# Altium project mecanum_car.PrjPcb
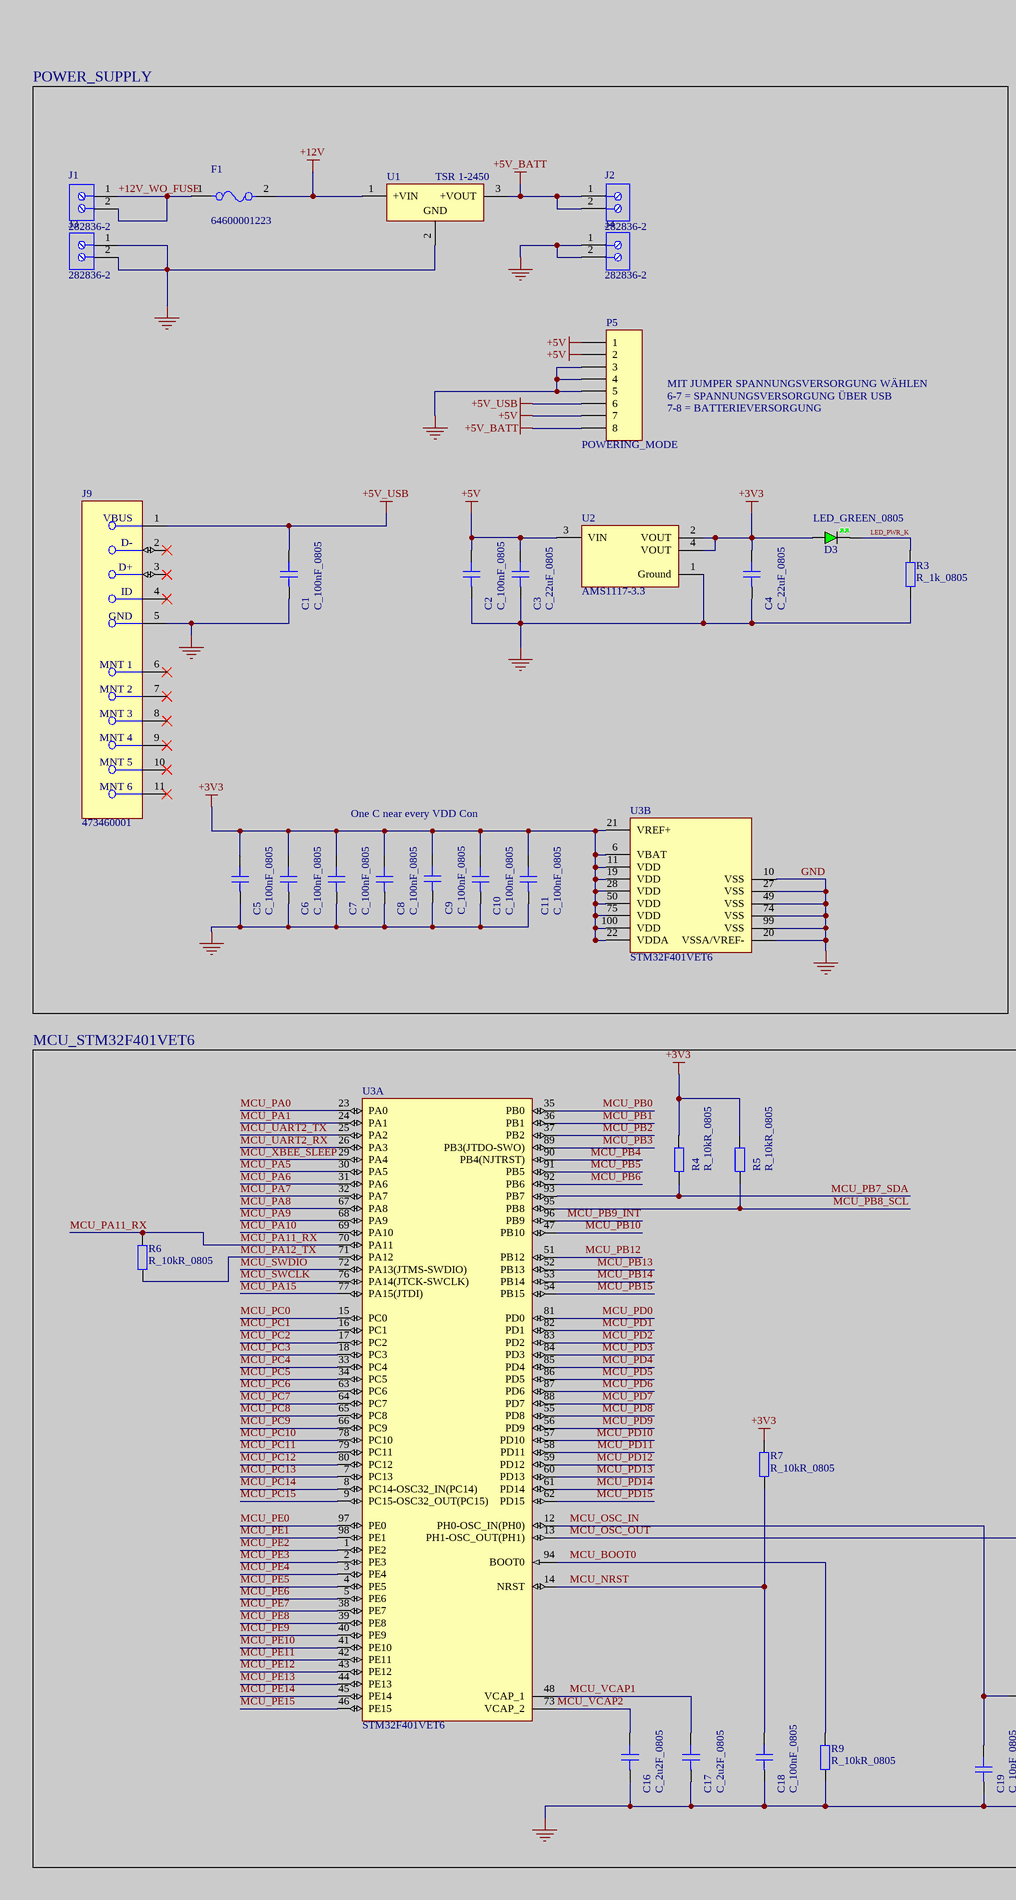
[diagram p0: mecanum_car.SchDoc, left]
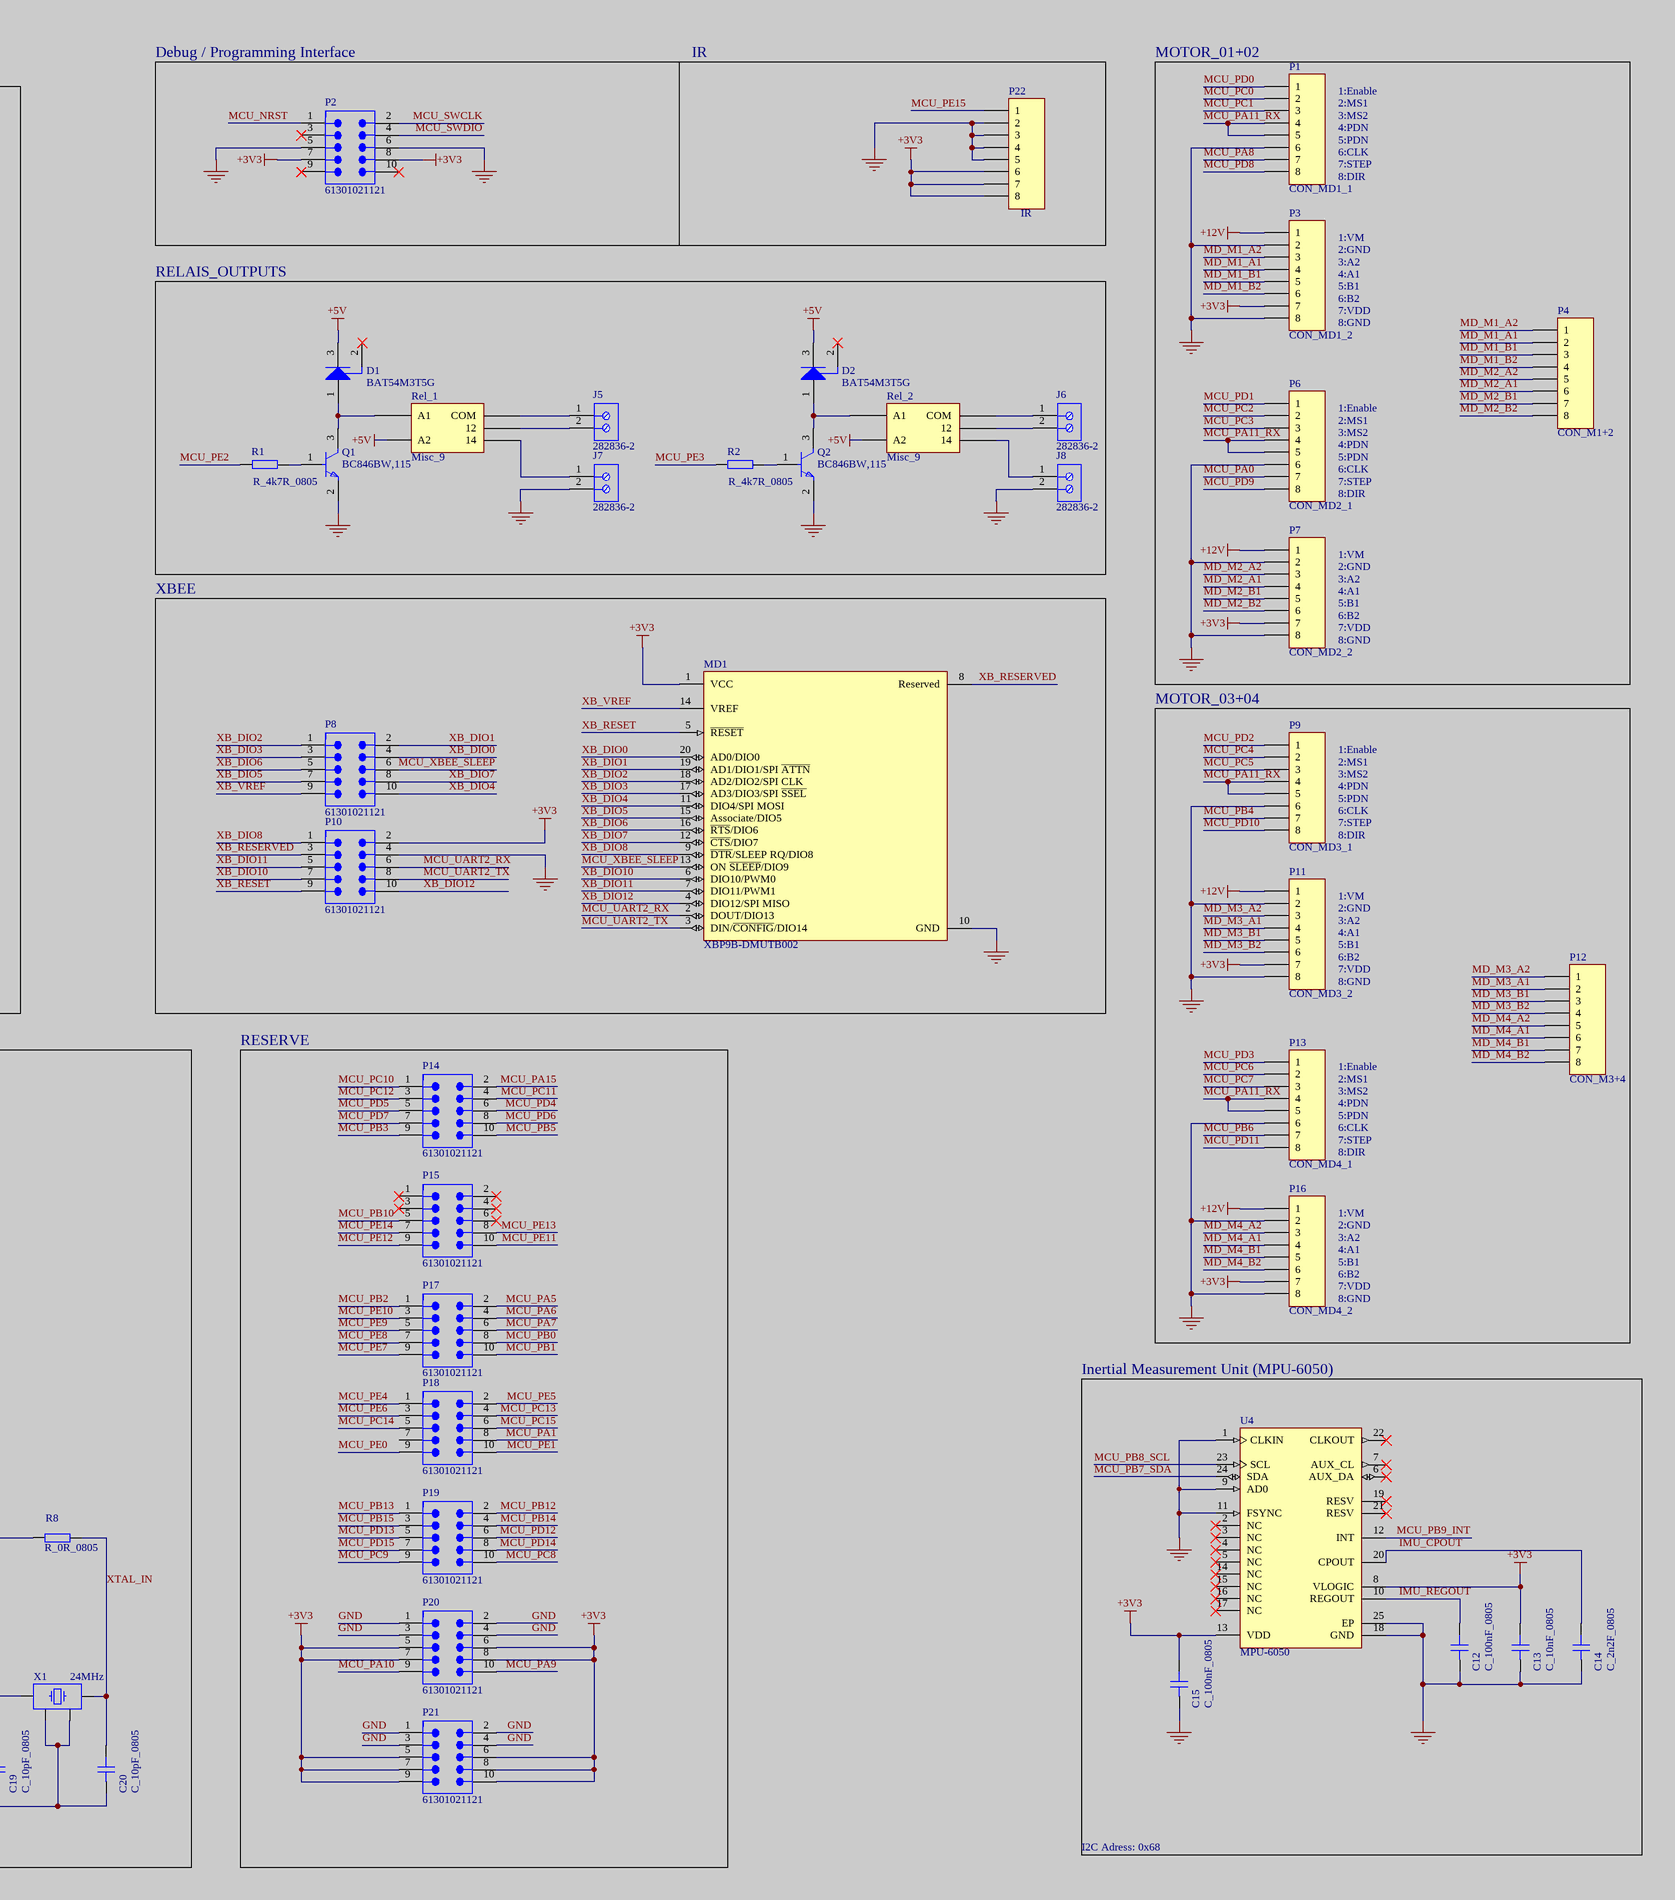
[diagram p1: mecanum_car.SchDoc, right]
1 sheet, 74 parts. Net scope: global (net labels, ports and power ports of the same name join across sheets).
Board file: mecanum_car.PcbDoc

## Sheet mecanum_car.SchDoc
size A2; SheetNumber: 1; SheetTotal: 1

### Parts
C1  C_100nF_0805  [CAP_0805]
C2  C_100nF_0805  [CAP_0805]
C3  C_22uF_0805  [CAP_0805]
C4  C_22uF_0805  [CAP_0805]
C5  C_100nF_0805  [CAP_0805]
C6  C_100nF_0805  [CAP_0805]
C7  C_100nF_0805  [CAP_0805]
C8  C_100nF_0805  [CAP_0805]
C9  C_100nF_0805  [CAP_0805]
C10  C_100nF_0805  [CAP_0805]
C11  C_100nF_0805  [CAP_0805]
C12  C_100nF_0805  [CAP_0805]
C13  C_10nF_0805  [CAP_0805]
C14  C_2n2F_0805  [CAP_0805]
C15  C_100nF_0805  [CAP_0805]
C16  C_2u2F_0805  [CAP_0805]
C17  C_2u2F_0805  [CAP_0805]
C18  C_100nF_0805  [CAP_0805]
C19  C_10pF_0805  [CAP_0805]
C20  C_10pF_0805  [CAP_0805]
D1  BAT54M3T5G  [ONSC-SOT-723-3-631AA-01_C_V]
D2  BAT54M3T5G  [ONSC-SOT-723-3-631AA-01_C_V]
D3  GREEN  [LED_0805_GREEN]  (value not drawn)
F1  64600001223  [FP-64600001223-MFG]
J1  282836-2  [TECO-282836-2_V]
J2  282836-2  [TECO-282836-2_V]
J3  282836-2  [TECO-282836-2_V]
J4  282836-2  [TECO-282836-2_V]
J5  282836-2  [TECO-282836-2_V]
J6  282836-2  [TECO-282836-2_V]
J7  282836-2  [TECO-282836-2_V]
J8  282836-2  [TECO-282836-2_V]
J9  473460001  [FP-473460001-MFG]
MD1  XBP9B-DMUTB002  [FP-XBP9B-DMUTB002-MFG]
P1  CON_MD1_1  [HDR1X8]
P2  61301021121  [61301021121]
P3  CON_MD1_2  [HDR1X8]
P4  CON_M1+2  [HDR1X8]
P5  POWERING_MODE  [HDR1X8]
P6  CON_MD2_1  [HDR1X8]
P7  CON_MD2_2  [HDR1X8]
P8  61301021121  [61301021121]
P9  CON_MD3_1  [HDR1X8]
P10  61301021121  [61301021121]
P11  CON_MD3_2  [HDR1X8]
P12  CON_M3+4  [HDR1X8]
P13  CON_MD4_1  [HDR1X8]
P14  61301021121  [61301021121]
P15  61301021121  [61301021121]
P16  CON_MD4_2  [HDR1X8]
P17  61301021121  [61301021121]
P18  61301021121  [61301021121]
P19  61301021121  [61301021121]
P20  61301021121  [61301021121]
P21  61301021121  [61301021121]
P22  IR  [HDR1X8]
Q1  BC846BW,115  [FP-SOT323-MFG]
Q2  BC846BW,115  [FP-SOT323-MFG]
R1  R_4k7R_0805  [RES_0805]
R2  R_4k7R_0805  [RES_0805]
R3  R_1k_0805  [RES_0805]
R4  R_10kR_0805  [RES_0805]
R5  R_10kR_0805  [RES_0805]
R6  R_10kR_0805  [RES_0805]
R7  R_10kR_0805  [RES_0805]
R8  R_0R_0805  [RES_0805]
R9  R_10kR_0805  [RES_0805]
Rel_1  Misc_9  [RELAIS_5V_230V]
Rel_2  Misc_9  [RELAIS_5V_230V]
U1  TSR 1-2450  [TRACO-SIP-3_V]
U2  AMS1117-3.3  [FP-AMS1117-IPC_C]
U3  STM32F401VET6  [STM-LQFP100_L]  (parts A,B of 2)
U4  MPU-6050  [IS-QFN-24_V]
X1  24MHz  [XTAL_3225]

### Blocks framed on the sheet
POWER_SUPPLY: C1-C11 D3 F1 J1-J4 J9 P5 R3 U1-U3
MOTOR_01+02: P1 P3 P4 P6 P7
RELAIS_OUTPUTS: D1 D2 J5-J8 Q1 Q2 R1 R2 Rel_1 Rel_2
XBEE: MD1 P8 P10
MOTOR_03+04: P9 P11-P13 P16
MCU_STM32F401VET6: C16-C20 R4-R9 U3 X1
RESERVE: P14 P15 P17-P21
Inertial Measurement Unit (MPU-6050): C12-C15 U4

### Nets
+3V3: C4.2 C5.2 C6.2 C7.2 C8.2 C9.2 C10.2 C11.2 C13.2 C15.2 D3.A MD1.1(VCC) P2.7 P2.8 P3.7 P7.7 P10.2 P11.7 P16.7 P20.5 P20.6 P20.7 P20.8 P21.5 P21.6 P21.7 P21.8 P21.9 P21.10 P22.6 P22.7 P22.8 R4.1 R5.1 R7.1 U2.2(VOUT) U2.4(VOUT) U3.6(VBAT) U3.11(VDD) U3.19(VDD) U3.21(VREF+) U3.22(VDDA) U3.28(VDD) U3.50(VDD) U3.75(VDD) U3.100(VDD) U4.8(VLOGIC) U4.13(VDD)
+5V: C2.2 C3.2 D1.3(K) D2.3(K) P5.1 P5.2 P5.7 Rel_1.A2 Rel_2.A2 U2.3(VIN)
+5V_BATT: J2.1 J2.2 P5.8 U1.3(+VOUT)
+5V_USB: C1.2 J9.1(VBUS) P5.6
+12V: F1.2 P3.1 P7.1 P11.1 P16.1 U1.1(+VIN)
GND: C1.1 C2.1 C3.1 C4.1 C5.1 C6.1 C7.1 C8.1 C9.1 C10.1 C11.1 C12.1 C13.1 C14.1 C15.1 C16.1 C17.1 C18.1 C19.1 C20.1 J3.1 J3.2 J4.1 J4.2 J7.2 J8.2 J9.5(GND) MD1.10(GND) P1.6 P2.5 P2.6 P3.2 P3.8 P5.3 P5.4 P5.5 P6.6 P7.2 P7.8 P9.6 P10.4 P11.2 P11.8 P13.6 P16.2 P16.8 P20.1 P20.2 P20.3 P20.4 P21.1 P21.2 P21.3 P21.4 P22.2 P22.3 P22.4 P22.5 Q1.2(E) Q2.2(E) R3.1 R9.2 U1.2(GND) U2.1(Ground) U3.10(VSS) U3.20(VSSA/VREF-) U3.27(VSS) U3.49(VSS) U3.74(VSS) U3.99(VSS) U4.1(CLKIN) U4.9(AD0) U4.11(FSYNC) U4.18(GND) U4.25(EP) X1.2 X1.4
+12V_WO_FUSE: F1.1 J1.1 J1.2
IMU_CPOUT: C14.2 U4.20(CPOUT)
IMU_REGOUT: C12.2 U4.10(REGOUT)
LED_PWR_K: D3.K R3.2
MCU_BOOT0: R9.1 U3.94(BOOT0)
MCU_NRST: C18.2 P2.1 R7.2 U3.14(NRST)
MCU_OSC_IN: C19.2 U3.12(PH0-OSC_IN(PH0)) X1.1
MCU_OSC_OUT: R8.1 U3.13(PH1-OSC_OUT(PH1))
MCU_PA0: P6.7 U3.23(PA0)
MCU_PA1: P18.8 U3.24(PA1)
MCU_PA5: P17.2 U3.30(PA5)
MCU_PA6: P17.4 U3.31(PA6)
MCU_PA7: P17.6 U3.32(PA7)
MCU_PA8: P1.7 U3.67(PA8)
MCU_PA9: P20.10 U3.68(PA9)
MCU_PA10: P20.9 U3.69(PA10)
MCU_PA11_RX: P1.4 P1.5 P6.4 P6.5 P9.4 P9.5 P13.4 P13.5 R6.1 U3.70(PA11)
MCU_PA12_TX: R6.2 U3.71(PA12)
MCU_PA15: P14.2 U3.77(PA15(JTDI))
MCU_PB0: P17.8 U3.35(PB0)
MCU_PB1: P17.10 U3.36(PB1)
MCU_PB2: P17.1 U3.37(PB2)
MCU_PB3: P14.9 U3.89(PB3(JTDO-SWO))
MCU_PB4: P9.7 U3.90(PB4(NJTRST))
MCU_PB5: P14.10 U3.91(PB5)
MCU_PB6: P13.7 U3.92(PB6)
MCU_PB7_SDA: R4.2 U3.93(PB7) U4.24(SDA)
MCU_PB8_SCL: R5.2 U3.95(PB8) U4.23(SCL)
MCU_PB9_INT: U3.96(PB9) U4.12(INT)
MCU_PB10: P15.5 U3.47(PB10)
MCU_PB12: P19.2 U3.51(PB12)
MCU_PB13: P19.1 U3.52(PB13)
MCU_PB14: P19.4 U3.53(PB14)
MCU_PB15: P19.3 U3.54(PB15)
MCU_PC0: P1.2 U3.15(PC0)
MCU_PC1: P1.3 U3.16(PC1)
MCU_PC2: P6.2 U3.17(PC2)
MCU_PC3: P6.3 U3.18(PC3)
MCU_PC4: P9.2 U3.33(PC4)
MCU_PC5: P9.3 U3.34(PC5)
MCU_PC6: P13.2 U3.63(PC6)
MCU_PC7: P13.3 U3.64(PC7)
MCU_PC8: P19.10 U3.65(PC8)
MCU_PC9: P19.9 U3.66(PC9)
MCU_PC10: P14.1 U3.78(PC10)
MCU_PC11: P14.4 U3.79(PC11)
MCU_PC12: P14.3 U3.80(PC12)
MCU_PC13: P18.4 U3.7(PC13)
MCU_PC14: P18.5 U3.8(PC14-OSC32_IN(PC14))
MCU_PC15: P18.6 U3.9(PC15-OSC32_OUT(PC15))
MCU_PD0: P1.1 U3.81(PD0)
MCU_PD1: P6.1 U3.82(PD1)
MCU_PD2: P9.1 U3.83(PD2)
MCU_PD3: P13.1 U3.84(PD3)
MCU_PD4: P14.6 U3.85(PD4)
MCU_PD5: P14.5 U3.86(PD5)
MCU_PD6: P14.8 U3.87(PD6)
MCU_PD7: P14.7 U3.88(PD7)
MCU_PD8: P1.8 U3.55(PD8)
MCU_PD9: P6.8 U3.56(PD9)
MCU_PD10: P9.8 U3.57(PD10)
MCU_PD11: P13.8 U3.58(PD11)
MCU_PD12: P19.6 U3.59(PD12)
MCU_PD13: P19.5 U3.60(PD13)
MCU_PD14: P19.8 U3.61(PD14)
MCU_PD15: P19.7 U3.62(PD15)
MCU_PE0: P18.9 U3.97(PE0)
MCU_PE1: P18.10 U3.98(PE1)
MCU_PE2: R1.1 U3.1(PE2)
MCU_PE3: R2.1 U3.2(PE3)
MCU_PE4: P18.1 U3.3(PE4)
MCU_PE5: P18.2 U3.4(PE5)
MCU_PE6: P18.3 U3.5(PE6)
MCU_PE7: P17.9 U3.38(PE7)
MCU_PE8: P17.7 U3.39(PE8)
MCU_PE9: P17.5 U3.40(PE9)
MCU_PE10: P17.3 U3.41(PE10)
MCU_PE11: P15.10 U3.42(PE11)
MCU_PE12: P15.9 U3.43(PE12)
MCU_PE13: P15.8 U3.44(PE13)
MCU_PE14: P15.7 U3.45(PE14)
MCU_PE15: P22.1 U3.46(PE15)
MCU_SWCLK: P2.2 U3.76(PA14(JTCK-SWCLK))
MCU_SWDIO: P2.4 U3.72(PA13(JTMS-SWDIO))
MCU_UART2_RX: MD1.2(DOUT/DIO13) P10.6 U3.26(PA3)
MCU_UART2_TX: MD1.3(DIN/~{CONFIG}/DIO14) P10.8 U3.25(PA2)
MCU_VCAP1: C17.2 U3.48(VCAP_1)
MCU_VCAP2: C16.2 U3.73(VCAP_2)
MCU_XBEE_SLEEP: MD1.13(ON_~{SLEEP}/DIO9) P8.6 U3.29(PA4)
MD_M1_A1: P3.4 P4.2
MD_M1_A2: P3.3 P4.1
MD_M1_B1: P3.5 P4.3
MD_M1_B2: P3.6 P4.4
MD_M2_A1: P4.6 P7.4
MD_M2_A2: P4.5 P7.3
MD_M2_B1: P4.7 P7.5
MD_M2_B2: P4.8 P7.6
MD_M3_A1: P11.4 P12.2
MD_M3_A2: P11.3 P12.1
MD_M3_B1: P11.5 P12.3
MD_M3_B2: P11.6 P12.4
MD_M4_A1: P12.6 P16.4
MD_M4_A2: P12.5 P16.3
MD_M4_B1: P12.7 P16.5
MD_M4_B2: P12.8 P16.6
XB_DIO0: MD1.20(AD0/DIO0) P8.4
XB_DIO1: MD1.19(AD1/DIO1/SPI_~{ATTN}) P8.2
XB_DIO2: MD1.18(AD2/DIO2/SPI_CLK) P8.1
XB_DIO3: MD1.17(AD3/DIO3/SPI_~{SSEL}) P8.3
XB_DIO4: MD1.11(DIO4/SPI_MOSI) P8.10
XB_DIO5: MD1.15(Associate/DIO5) P8.7
XB_DIO6: MD1.16(~{RTS}/DIO6) P8.5
XB_DIO7: MD1.12(~{CTS}/DIO7) P8.8
XB_DIO8: MD1.9(~{DTR}/SLEEP_RQ/DIO8) P10.1
XB_DIO10: MD1.6(DIO10/PWM0) P10.7
XB_DIO11: MD1.7(DIO11/PWM1) P10.5
XB_DIO12: MD1.4(DIO12/SPI_MISO) P10.10
XB_RESERVED: MD1.8(Reserved) P10.3
XB_RESET: MD1.5(~{RESET}) P10.9
XB_VREF: MD1.14(VREF) P8.9
XTAL_IN: C20.2 R8.2 X1.3
NetD1_1: D1.1(A) Q1.3(C) Rel_1.A1
NetD2_1: D2.1(A) Q2.3(C) Rel_2.A1
NetJ5_1: J5.1 Rel_1.11(COM)
NetJ5_2: J5.2 Rel_1.12
NetJ6_1: J6.1 Rel_2.11(COM)
NetJ6_2: J6.2 Rel_2.12
NetJ7_1: J7.1 Rel_1.14
NetJ8_1: J8.1 Rel_2.14
NetQ1_1: Q1.1(B) R1.2
NetQ2_1: Q2.1(B) R2.2

Not connected (* = marked no-connect by the designer): D1 2(NC)*; D2 2(NC)*; J9 2(D-)* 3(D+)* 4(ID)* 6(MNT_1)* 7(MNT_2)* 8(MNT_3)* 9(MNT_4)* 10(MNT_5)* 11(MNT_6)*; P2 3* 9* 10*; P15 1* 2* 3* 4* 6*; P18 7; U4 2(NC)* 3(NC)* 4(NC)* 5(NC)* 6(AUX_DA)* 7(AUX_CL)* 14(NC)* 15(NC)* 16(NC)* 17(NC)* 19(RESV)* 21(RESV)* 22(CLKOUT)*

### Notes on the sheet
- Debug / Programming Interface
- IR
- 1:Enable
- 2:MS1
- 3:MS2
- 4:PDN
- 5:PDN
- 6:CLK
- 7:STEP
- 8:DIR
- 1:VM
- 2:GND
- 3:A2
- 4:A1
- 5:B1
- 6:B2
- 7:VDD
- 8:GND
- MIT JUMPER SPANNUNGSVERSORGUNG WÄHLEN
- 6-7 = SPANNUNGSVERSORGUNG ÜBER USB
- 7-8 = BATTERIEVERSORGUNG
- (near D3) LED_GREEN_0805
- One C near every VDD Con
- I2C Adress: 0x68

### Library data of the parts
C1-C20 = CAP_0805: Capacitor SMD 0805; Manufacturer: *; Manufacturer Part Number: *; Distributor Link: *; LCSC: *; Rating: *; Dielectric: *
D1 D2 = CMP-1055-00587-1: Schottky Barrier Diode, 3-Pin SOT-723, Pb-Free, Tape and Reel; Manufacturer: On Semiconductor; IFSM Max (A): 0.6; trr Max (ns): 5; Configuration: Single; PackageDescription: 3-Pin SOT223, Body 0.8 x 1.2 mm, Pitch 0.4 mm; ComponentLink3URL: http://www.onsemi.cn/pub_link/Collateral/BAT54M3-D.PDF; ComponentLink2URL: http://www.onsemi.cn/pub_link/Collateral/BAT54M3-D.PDF; ComponentLink3Description: Package Specification; ComponentLink1Description: Manufacturer URL; ComponentLink1URL: http://www.onsemi.com/; RoHS: TRUE; PartNumber: BAT54M3T5G; PackageReference: SOT-723-3-631AA-01_C; Packing: Tape and Reel; PackageVersion: Rev. C, 08/2006; ComponentLink2Description: Datasheet; DatasheetVersion: Rev. 0; Mounting Technology: Surface Mount
D3 = LED_0805_GREEN: LED 0805 GREEN SMD; Manufacturer: *; Manufacturer Part Number: *; Distributor Link: *; LCSC: *
F1 = CMP-08604-000020-1: FUSE BLOCK CART 250V 6.3A PCB; Manufacturer: Littelfuse Inc; Number Of Fuses: 1; Conn Orientation: Horizontal; ComponentLink2URL: https://www.littelfuse.com/~/media/electronics/datasheets/fuse_blocks/littelfuse_fuse_block_646_datasheet.pdf.pdf; Manufacturer Part Number: 64600001223; Mouser Description: Fuse Holder Screw Mount Bulk; Voltage Rating Ac: 250V; Voltage Rating Dc: 250V; Category: Fuse; Fuse Current: 6.3A; Octopart: https://octopart.com/64600001223-littelfuse-39645661; Package: 0; Automotive: No; Height: 12mm; Device Class L3: unset; ComponentLink2Description: Datasheet; Digikey Description: FUSE BLOCK CART 250V 6.3A PCB; Device Class L1: Circuit Protection; Lead Free: Yes; Device Class L2: Fuse Holders; RoHS: TRUE
J1-J8 = CMP-1684-00017-1: Female Header, Pitch 5 mm, 1 x 2 Position, Height 10 mm, Tail Length 3.5 mm, Rohs, Bulk; Manufacturer: TE Connectivity; Wire Gauge: 16-30AWG; Product Training Modules: Wire-to-BoardEurostyleTerminalBlocks; Clamp Material - Plating: Brass-NickelPlated; Voltage: 300V; Mating Orientation: HorizontalwithBoard; Current: 13.5A; Pitch: 0.197"(5.00mm); Screw Thread: M3; 3D Model: 282836-2.pdf; Other Names: 5ULV-02B / A98076; Dynamic Catalog: BuchananSeries; Number of Levels: 1; Torque - Screw: 0.68Nm(6Lb-In); Featured Product: EurostyleTerminalBlockConnectors; Positions Per Level: 2; Wire Termination: Screw-RisingCageClamp; Datasheet URL: http://www.te.com.cn/commerce/DocumentDelivery/DDEController?Action=showdoc&DocId=Catalog+Section%7F1308389_EUROSTYLE_TERMINAL_BLOCKS%7F0607%7Fpdf%7FEnglish%7FENG_CS_1308389_EUROSTYLE_TERMINAL_BLOCKS_0607.pdf%7F282836-2; Color: Green; Family: TerminalBlocks-WiretoBoard; RoHS Information: 282836-2StatementofCompliance; Standard Package: 300; Contact Material - Plating: Brass-TinPlated; Manufacturer URL: http://www.te.com; Housing Material: Polyamide(PA66),Nylon6/6; Features: Interlocking(Side); Package Description: Female Header, Pitch 5 mm, 1 x 2 Position, Height 10 mm, Tail Length 3.5 mm; Mounting Type: ThroughHole; Package Reference: THD; Packaging: Bulk; Series: Buchanan; Category: Connectors,Interconnects; Screw Material - Plating: Brass-NickelPlated
J9 = CMP-2000-05246-2: CONN RCPT USB2.0 MICRO B SMD R/A; Manufacturer: Molex; Conn Orientation: Right Angle; Is Female: yes; Shielding: true; Pitch: 0.65mm; Number Of Contacts: 5; Voltage Rating: 30V; Current Rating: 1.8A; Device Class L2: USB Connectors; Digikey Description: CONN RCPT USB2.0 MICRO B SMD R/A; Height: 2.945mm; RoHS: TRUE; ComponentLink2Description: Datasheet; Octopart: https://octopart.com/47346-0001-molex-7164928; Automotive: No; Package: 0; Category: Conn; Device Class L1: Connectors; Usb Standard: USB 2.0; Temperature: -30°C to +85°C; Temperature Range Low: -30°C; Footprint Url: https://www.molex.com/pdm_docs/sd/473460001_sd.pdf; ComponentLink2URL: https://www.molex.com/webdocs/datasheets/pdf/en-us/0473460001_IO_CONNECTORS.pdf; Lead Free: Yes; Manufacturer Part Number: 473460001; Contact Material: Gold,Nickel; Temperature Range High: +85°C; Device Class L3: unset
MD1 = CMP-84319-000004-1: RX TXRX MOD ISM < 1GHZ U.FL TH; Max Supply Voltage: 3.6V; Current - Transmitting: 215mA; Sensitivity: -101dBm; Min Frequency: 902MHz; Memory Size: 2KB; Max Frequency: 928MHz; Min Supply Voltage: 2.4V; Current - Receiving: 29mA; Interface: SPI; Data Rate: 200Kbps; Frequency: 900MHz; Output Power (dBm): 24dBm; Number of Pins: 20; Series: XBee-Pro™; Max Operating Temperature: 85°C; Radiation Hardening: No; Min Operating Temperature: -40°C; Package Quantity: 1; RAM Size: 2KB; Packaging: Bulk; Case/Package: Module
P1 P3-P7 P9 P11-P13 P16 P22 = CMP-006-000031-1: QR: 0; UID: Con_38; Pin Count: 8; Component Type: Standard; Source: Connectors$.SchLib; Pins: 1X8; mounting: THT; Design Item ID: Con_38
P2 P8 P10 P14 P15 P17-P21 = CMP-1502-01084-3: NexarPartId: 18818163; Connector Type: Male Pin; Insulation Resistance: 1GΩ; Row Spacing: 2.54mm; Insulation: Insulated; Number of Positions: 10; Current Rating: 3A; Voltage Rating: 250V; Gender: Male; Contact Resistance: 20mΩ; Contact Gender: Male; Number of Rows: 2; Min Operating Temperature: -40°C; Mount: Through Hole; Packaging: Bulk; Length: 12.7mm; Pitch: 2.54mm; RoHS: Compliant; Height: 2.54mm; Lead Pitch: 2.54mm; Number of Pins: 10; Housing Material: PBT; Orientation: Vertical; Flammability Rating: UL94 V-0; Termination: Through Hole; Width: 12.7mm; Color: Black; Contact Mating Length: 5.9944mm; Max Operating Temperature: 105°C; Operating Supply Voltage: 250V; Contact Material: Copper; Number of Contacts: 10; Contact Plating: Gold; REACH SVHC: Unknown
Q1 Q2 = CMP-14406-000016-1: TRANS NPN 65V 0.1A SOT323; Manufacturer: Nexperia; Power Dissipation: 200mW; Max Collector Current: 100mA; Hfe Min: 110; Collector Emitter Saturation Voltage: 200mV; Automotive Grade: Grade 0; Unity Gain Freq: 100MHz; Rthja Max: 625K/W; Number Of Elements: 1; Hfe Max: 450; Collector Base Voltage: 80V; Max Junction Temp: +150°C; Hfe Testvce: 5V; Emitter Base Voltage: 6V; Hfe Testic: 2mA; Digikey Description: TRANS NPN 65V 0.1A SOT323; Octopart: https://octopart.com/bc846bw%2C115-nexperia-78739096; Device Class L3: BJTs; Device Class L2: Transistors; Category: Trans; Lead Free: Yes; ComponentLink2URL: https://assets.nexperia.com/documents/data-sheet/BC846_SER.pdf; Collector Emitter Voltage: 65V; Automotive: Yes; Footprint Url: https://assets.nexperia.com/documents/outline-drawing/SOT323.pdf; Temperature Range High: +150°C; Device Class L1: Discrete Semiconductors; Number Of Npn: 1; Package: SOT323; ComponentLink2Description: Datasheet; Manufacturer Part Number: BC846BW,115; Ambient Temperature Range High: +150°C; Ambient Temperature Range Low: -65°C; RoHS: TRUE; Height: 1.1mm; Temperature: to +150°C
R1-R9 = RES_0805: Resistor SMD 0805; Manufacturer: *; Manufacturer Part Number: *; Distributor Link: *; LCSC: *
Rel_1 Rel_2 = CMP-008-000007-1: QR: 0; RS_number: 511-2142; Source: Miscellaneous$.SchLib; mounting: THT; Name_Hyperlink: https://at.rs-online.com/web/p/monostabile-relais/5112142/?searchTerm=511-2142&relevancy-data=636F3D3126696E3D4931384E525353746F636B4E756D6265724D504E266C753D656E266D6D3D6D61746368616C6C26706D3D5E5C647B337D5B5C732D2F255C2E2C5D5C647B332C347D2426706F3D31342; UID: Misc_9; Design Item ID: Misc_9
U1 = CMP-2000-05427-1: DC/DC converter, 5 VDC, 1000 mA, -40 to 85 degC, 3-Pin SIP, RoHS; Manufacturer: Tracopower; Output Voltage Nom.: 5V; Output Current Max: 1A; Product Range: TSR-1Series; DC / DC Converter Mounting: ThroughHole; Output Power Max: 5W; No. of Outputs: 1Output; Input Voltage DC Max: 36V; Approvals & Standards: IEC,UL; Input Voltage DC Min: 6.5V; DC / DC Converter Output Type: Fixed; Depth: 11.7mm; Package Reference: SIP-3; DC / DC Converter Type: SIP; Height: 10.2mm; Width: 7.6mm; Package Description: 3-Pin Single In-line Package, Body 11.7 x 7.6 mm, Pitch 2.54 mm; Manufacturer URL: http://www.tracopower.com/home; Datasheet Version: Jan-15; Datasheet URL: https://datasheet.ciiva.com/6815/tsr1-6815641.pdf
U2 = CMP-209535-000001-1: LDO Voltage Regulators 1A, 3.3V; Manufacturer: Advanced Monolithic Systems; Dropout Voltage: 1.1V; Output Type: Fixed; Nominal Supply Current: 5mA; Max Power Dissipation: 1.2W; Max Supply Voltage: 15V; Number Of Outputs: 1; Standoff Height: 0.64mm; Max Junction Temp: +125°C; Height: 1.8mm; Package: AMS1117; Device Class L2: Power Management ICs; ComponentLink2Description: Datasheet; ComponentLink2URL: http://www.advanced-monolithic.com/pdf/ds1117.pdf; Category: IC; RoHS: TRUE; Automotive: No; Device Class L1: Integrated Circuits (ICs); Output Current: 1A; Device Class L3: Voltage Regulators - Linear; Temperature: -40°C to +125°C; Output Voltage: 3.3V; Manufacturer Part Number: AMS1117-3.3; Temperature Range Low: -40°C; Octopart: https://octopart.com/ams1117-3.3-advanced+monolithic+systems-25899300; Lead Free: Yes; Ipc Land Pattern Name: SOT229P700X180-4; Temperature Range High: +125°C
U3 = CMP-0243-00155-1: ARM Cortex-M4 32-bit MCU+FPU, 512 KB Flash, 96 KB Internal RAM, 81 I/Os, 100-Pin LQFP, -40 to 85 degC, Tray; Internal RAM Size (kB): 96; Operating Frequency(F) (Processor speed) (MHz): 84; FLASH Size (Prog) (kB): 512; Supply Voltage(Vcc) min (V): 1.7; I/Os (High Current): 81; Mounting Technology: Surface Mount; DatasheetVersion: Rev. 3; Packing: Tray; ComponentLink2Description: Datasheet; ComponentLink1URL: http://www.st.com/; ComponentLink1Description: Manufacturer URL; Core: ARM Cortex-M4; Package Reference: 100-Pin Low Profile Quad Flat Package, Body 14 x 14 mm, Pitch 0.5 mm; ComponentLink2URL: http://www.st.com/st-web-ui/static/active/en/resource/technical/document/datasheet/DM00102166.pdf; Package Description: LQFP100
U4 = CMP-1753-00002-2: 3-Axis Gyroscope, Accelerometer and a Digital Motion Processor(TM) (DMP), 2.375 to 3.46 V, -40 to 85 degC, 24-Pin QFN, RoHS, Tape and Reel; Manufacturer: InvenSense; Featured Product: MPU-60506-Axis,IntegratedI²CSolution; Other Names: 1428-1007-2 / MPU6050; Sensor Type: MotionTracking; Online Catalog: MPU-6000™Series; Unit PriceUSD: Digital; Datasheet Version: Rev. 3.3, 05/2012; Category: Sensors,Transducers; Datasheet URL: http://datasheet.octopart.com/MPU-6050-InvenSense-datasheet-14421344.pdf; Family: Multifunction; Standard Package: 5,000; Manufacturer URL: http://www.invensense.com/; Output Type: Digital; Dynamic Catalog: MPU-6000™Series
X1 = TSX-3225_24.0000MF15X-AC: Crystal SMD 24MHz 10PPM 7pF 3225; Manufacturer: Epson; Manufacturer Part Number: TSX-3225 24.0000MF15X-AC